# Altium schematic sheet Top_Layer.SchDoc
size E
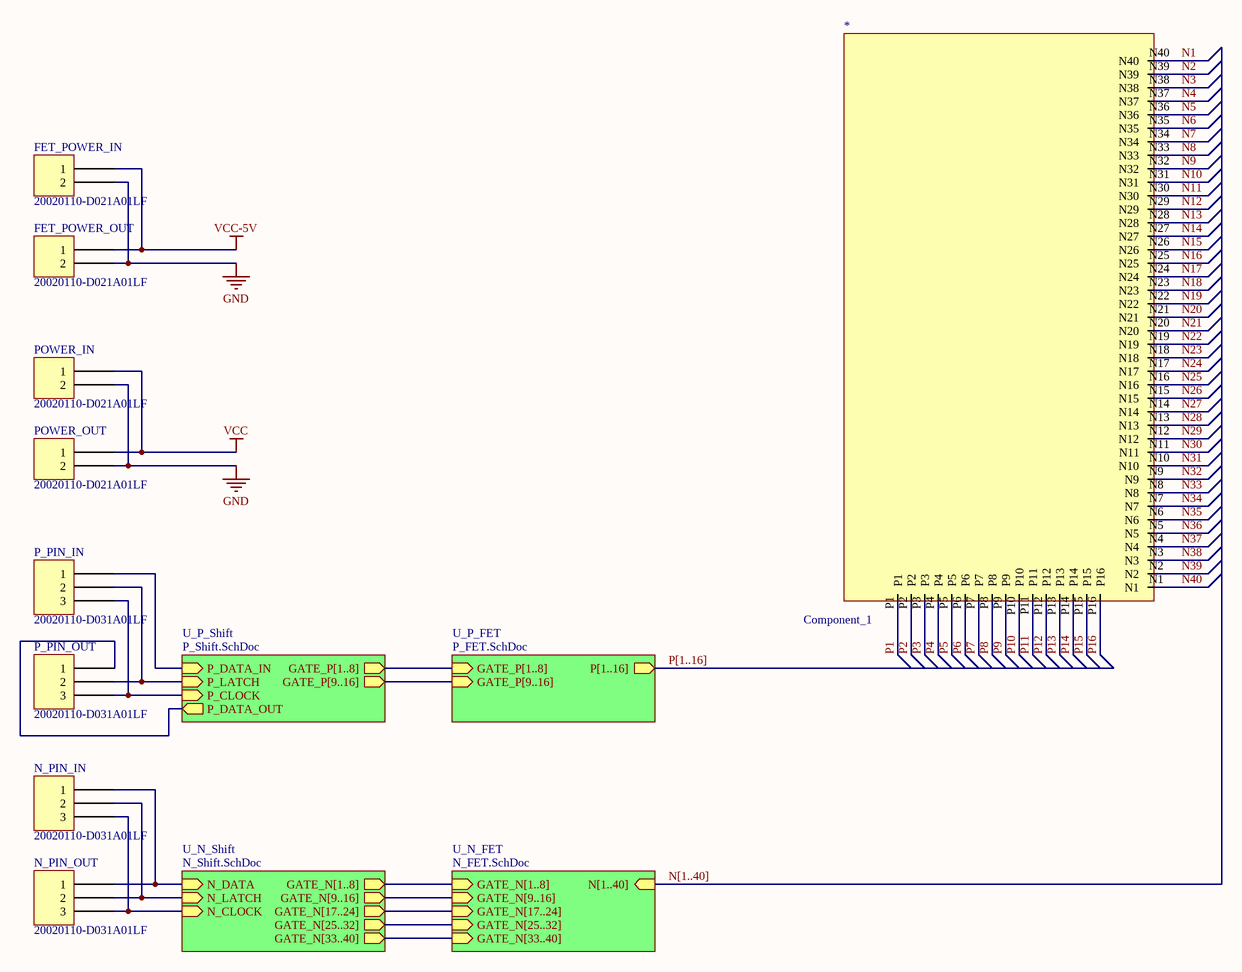
[diagram p0: Top_Layer.SchDoc]

## Parts
*  Component_1  [PCBComponent_1]
FET_POWER_IN  20020110-D021A01LF  [FCI 06-381-2PIN]
FET_POWER_OUT  20020110-D021A01LF  [FCI 06-381-2PIN]
N_PIN_IN  20020110-D031A01LF  [FCI 06-381-3PIN]
N_PIN_OUT  20020110-D031A01LF  [FCI 06-381-3PIN]
P_PIN_IN  20020110-D031A01LF  [FCI 06-381-3PIN]
P_PIN_OUT  20020110-D031A01LF  [FCI 06-381-3PIN]
POWER_IN  20020110-D021A01LF  [FCI 06-381-2PIN]
POWER_OUT  20020110-D021A01LF  [FCI 06-381-2PIN]

## Sub-sheets
U_N_FET = N_FET.SchDoc: GATE_N[1..8] (in), GATE_N[9..16] (in), GATE_N[17..24] (in), GATE_N[25..32] (in), N[1..40] (in), GATE_N[33..40] (in)
U_N_Shift = N_Shift.SchDoc: GATE_N[1..8] (out), GATE_N[9..16] (out), GATE_N[17..24] (out), GATE_N[25..32] (out), GATE_N[33..40] (out), N_DATA (in), N_LATCH (in), N_CLOCK (in)
U_P_FET = P_FET.SchDoc: P[1..16] (out), GATE_P[1..8] (in), GATE_P[9..16] (in)
U_P_Shift = P_Shift.SchDoc: P_LATCH (in), P_CLOCK (in), GATE_P[1..8] (out), GATE_P[9..16] (out), P_DATA_IN (in), P_DATA_OUT (out)

## Nets
GND: FET_POWER_IN.2 FET_POWER_OUT.2 POWER_IN.2 POWER_OUT.2
VCC: POWER_IN.1 POWER_OUT.1
VCC-5V: FET_POWER_IN.1 FET_POWER_OUT.1
N1: *.N40
N2: *.N39
N3: *.N38
N4: *.N37
N5: *.N36
N6: *.N35
N7: *.N34
N8: *.N33
N9: *.N32
N10: *.N31
N11: *.N30
N12: *.N29
N13: *.N28
N14: *.N27
N15: *.N26
N16: *.N25
N17: *.N24
N18: *.N23
N19: *.N22
N20: *.N21
N21: *.N20
N22: *.N19
N23: *.N18
N24: *.N17
N25: *.N16
N26: *.N15
N27: *.N14
N28: *.N13
N29: *.N12
N30: *.N11
N31: *.N10
N32: *.N9
N33: *.N8
N34: *.N7
N35: *.N6
N36: *.N5
N37: *.N4
N38: *.N3
N39: *.N2
N40: *.N1
P1: *.P1
P2: *.P2
P3: *.P3
P4: *.P4
P5: *.P5
P6: *.P6
P7: *.P7
P8: *.P8
P9: *.P9
P10: *.P10
P11: *.P11
P12: *.P12
P13: *.P13
P14: *.P14
P15: *.P15
P16: *.P16
NetN_PIN_IN_1: N_PIN_IN.1 N_PIN_OUT.1 ; sheet U_N_Shift/N_DATA
NetN_PIN_IN_2: N_PIN_IN.2 N_PIN_OUT.2 ; sheet U_N_Shift/N_LATCH
NetN_PIN_IN_3: N_PIN_IN.3 N_PIN_OUT.3 ; sheet U_N_Shift/N_CLOCK
NetP_PIN_IN_1: P_PIN_IN.1 ; sheet U_P_Shift/P_DATA_IN
NetP_PIN_IN_2: P_PIN_IN.2 P_PIN_OUT.2 ; sheet U_P_Shift/P_LATCH
NetP_PIN_IN_3: P_PIN_IN.3 P_PIN_OUT.3 ; sheet U_P_Shift/P_CLOCK
NetP_PIN_OUT_1: P_PIN_OUT.1 ; sheet U_P_Shift/P_DATA_OUT

## Buses and harness runs
bus N[1..40] = sheet U_N_FET/N[1..40]
bus P[1..16] = sheet U_P_FET/P[1..16]
bus sheet U_N_FET/GATE_N[1..8] = sheet U_N_Shift/GATE_N[1..8]
bus sheet U_N_FET/GATE_N[9..16] = sheet U_N_Shift/GATE_N[9..16]
bus sheet U_N_FET/GATE_N[17..24] = sheet U_N_Shift/GATE_N[17..24]
bus sheet U_N_FET/GATE_N[25..32] = sheet U_N_Shift/GATE_N[25..32]
bus sheet U_N_FET/GATE_N[33..40] = sheet U_N_Shift/GATE_N[33..40]
bus sheet U_P_FET/GATE_P[1..8] = sheet U_P_Shift/GATE_P[1..8]
bus sheet U_P_FET/GATE_P[9..16] = sheet U_P_Shift/GATE_P[9..16]

## Library data of the parts
FET_POWER_IN FET_POWER_OUT POWER_IN POWER_OUT = 20020110-D021A01LF: TERM BLOCK HDR 2POS R/A 3.81MM; Manufacturer: FCI; TemperatureRange: -40C ~ 115C; Voltage: 300V; Pitch: 0.150" (3.81mm); Number Of Positions: 2; Number Of Levels: 1; Part Number: 20020110-D021A01LF; PartId: 7785; Supplier 1: Digi-Key; Supplier Part Number 1: 609-3819-ND; ComponentLink1Description: Datasheet; ComponentLink1URL: http://portal.fciconnect.com/Comergent//fci/drawing/20020110.pdf; ComponentLink2Description: Digi-Key Listing; ComponentLink2URL: http://www.digikey.ca/product-detail/en/20020110-D021A01LF/609-3819-ND/2261255; Price: .75; Type: Through Hole; Colour: Green; Orientation: 90, Right Angle; Positions Per Level: 2
N_PIN_IN N_PIN_OUT P_PIN_IN P_PIN_OUT = 20020110-D031A01LF: TERM BLOCK HDR 3POS R/A 3.81MM; Manufacturer: FCI; TemperatureRange: -40C ~ 115C; Voltage: 300V; Pitch: 0.150" (3.81mm); Number Of Positions: 3; Number Of Levels: 1; Part Number: 20020110-D031A01LF; PartId: 7786; Supplier 1: Digi-Key; Supplier Part Number 1: 609-3820-ND; ComponentLink1Description: Datasheet; ComponentLink1URL: http://portal.fciconnect.com/Comergent//fci/drawing/20020110.pdf; ComponentLink2Description: Digi-Key Listing; ComponentLink2URL: http://www.digikey.ca/product-detail/en/20020110-D031A01LF/609-3820-ND/2261261; Price: 1.12; Type: Through Hole; Colour: Green; Orientation: 90, Right Angle; Positions Per Level: 3